# Altium project Bop_It_PCB.PrjPcb
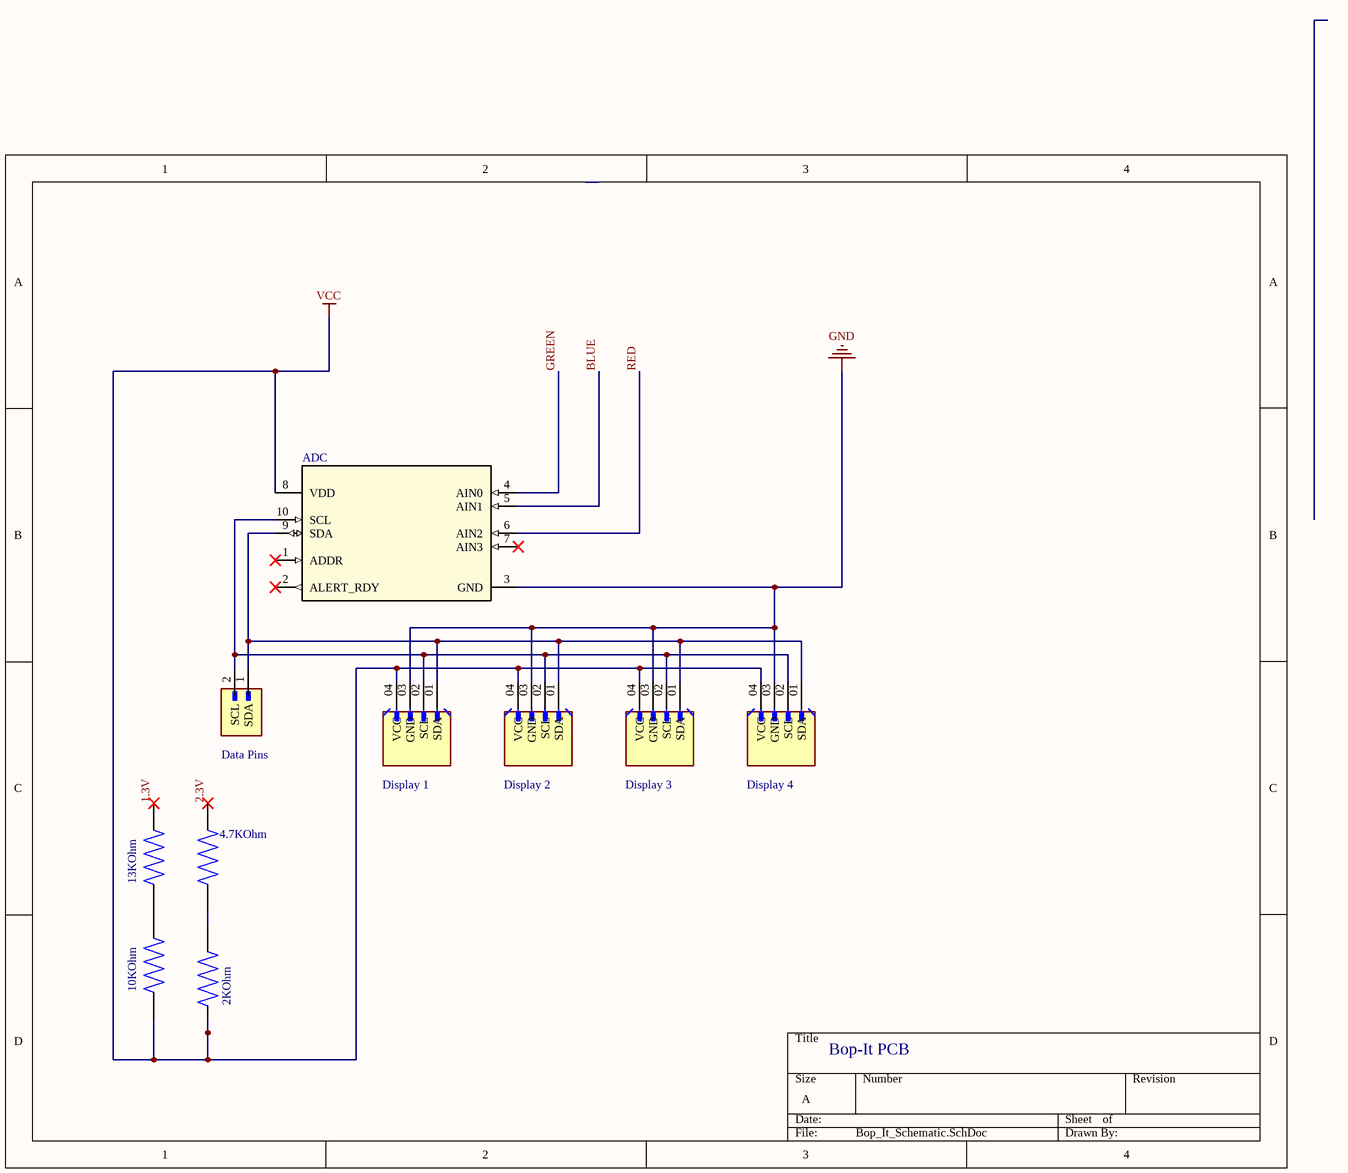
[diagram p0: Bop_It_Schematic.SchDoc]
1 sheet, 10 parts. Net scope: global (net labels, ports and power ports of the same name join across sheets).
Board file: Bop_it_Layout.PcbDoc

## Sheet Bop_It_Schematic.SchDoc
size A; SheetNumber: 1; SheetTotal: 1

### Parts
2KOhm  ERJ-12ZYJ202U  [RESC5025X70N]  (value not drawn)
4.7KOhm  RMCF1210JT4K70  [RESC3225X70N]  (value not drawn)
10KOhm  ERJ8ENF1002V  [RES_ERJ8ENF1002V]  (value not drawn)
13KOhm  ERJ8ENF1302V  [RES_ERJ8ENF1302V]  (value not drawn)
ADC  ADS1115IDGST  [DGS0010A_N]  (value not drawn)
Data_Pins  M20-9990246  [HARWIN_M20-9990246]  (value not drawn)
Display_1  61300411121  [WURTH_61300411121]  (value not drawn)
Display_2  61300411121  [WURTH_61300411121]  (value not drawn)
Display_3  61300411121  [WURTH_61300411121]  (value not drawn)
Display_4  61300411121  [WURTH_61300411121]  (value not drawn)

### Nets
GND: ADC.3(GND) Display_1.03(GND) Display_2.03(GND) Display_3.03(GND) Display_4.03(GND)
VCC: 2KOhm.1 10KOhm.2 ADC.8(VDD) Display_1.04(VCC) Display_2.04(VCC) Display_3.04(VCC) Display_4.04(VCC)
1.3V: 13KOhm.2
2.3V: 4.7KOhm.2
BLUE: ADC.5(AIN1)
GREEN: ADC.4(AIN0)
RED: ADC.6(AIN2)
Net2KOhm_2: 2KOhm.2 4.7KOhm.1
Net10KOhm_1: 10KOhm.1 13KOhm.1
NetADC_9: ADC.9(SDA) Data_Pins.1(SDA) Display_1.01(SDA) Display_2.01(SDA) Display_3.01(SDA) Display_4.01(SDA)
NetADC_10: ADC.10(SCL) Data_Pins.2(SCL) Display_1.02(SCL) Display_2.02(SCL) Display_3.02(SCL) Display_4.02(SCL)

Not connected (* = marked no-connect by the designer): ADC 1(ADDR)* 2(ALERT_RDY)* 7(AIN3)*

### Notes on the sheet
- Bop-It PCB

### Library data of the parts
4.7KOhm = RMCF1210JT4K70: 4.7 kOhms Â±5% 0.333W, 1/3W Chip Resistor 1210 (3225 Metric) Automotive AEC-Q200 Thick Film; MF: Stackpole Electronics Inc; Availability: Good; MP: RMCF1210JT4K70; Arrow_Electronics-Purchase-URL: https://snapeda.com/shop?store=Arrow+Electronics&id=3964293; DigiKey-Purchase-URL: https://snapeda.com/shop?store=DigiKey&id=3964293; SnapEDA_Link: https://www.snapeda.com/parts/RMCF1210JT4K70/Stackpole%20Electronics%20Inc/view-part/3964293/?ref=snap; Value: *; Package: 3225 Stackpole; Price: None
10KOhm = ERJ8ENF1002V: MF: {'manufacturer': u'Panasonic Electronic Components'}; Package: None; Price: None; Value: *; MP: ERJ8ENF1002V; Availability: Unavailable
ADC = ADS1115IDGST: 16-bit, 860-SPS, 4-channel, delta-sigma ADC with PGA, oscillator, VREF, comparator and I2C 10-VSSOP -40 to 125; Manufacturer_Name: Texas Instruments; TYPE: TYPE; RefDes: RefDes; Copyright: Copyright (C) 2025 Ultra Librarian. All rights reserved.; Manufacturer_Part_Number: ADS1115IDGST
Data_Pins = M20-9990246: 2.54mm (0.1) Pitch SIL Vertical Throughboard Pin Header, 6.1mm mating pin height, tin, 2 contacts; MF: Harwin; SnapEDA_Link: https://www.snapeda.com/parts/M20-9990246/Harwin/view-part/?ref=snap; Package: None; Value: *; MP: M20-9990246; Check_prices: https://www.snapeda.com/parts/M20-9990246/Harwin/view-part/?ref=eda
Display_1-Display_4 = 61300411121: Connector Header Through Hole 4 position 0.100 (2.54mm); MF: WÃ¼rth Elektronik; SnapEDA_Link: https://www.snapeda.com/parts/61300411121/W%25C3%25BCrth+Elektronik+Midcom/view-part/?ref=snap; Package: None; Value: *; MP: 61300411121; Check_prices: https://www.snapeda.com/parts/61300411121/W%25C3%25BCrth+Elektronik+Midcom/view-part/?ref=eda
2KOhm = ERJ-12ZYJ202U: Package: None; Price: None; Value: *; MP: ERJ-12ZYJ202U; Availability: Unavailable
13KOhm = ERJ8ENF1302V: Package: None; MP: ERJ8ENF1302V; Availability: Unavailable; Price: None; Value: *